# EAGLE schematic SchaltplanDoku (EAGLE 9.6.2)
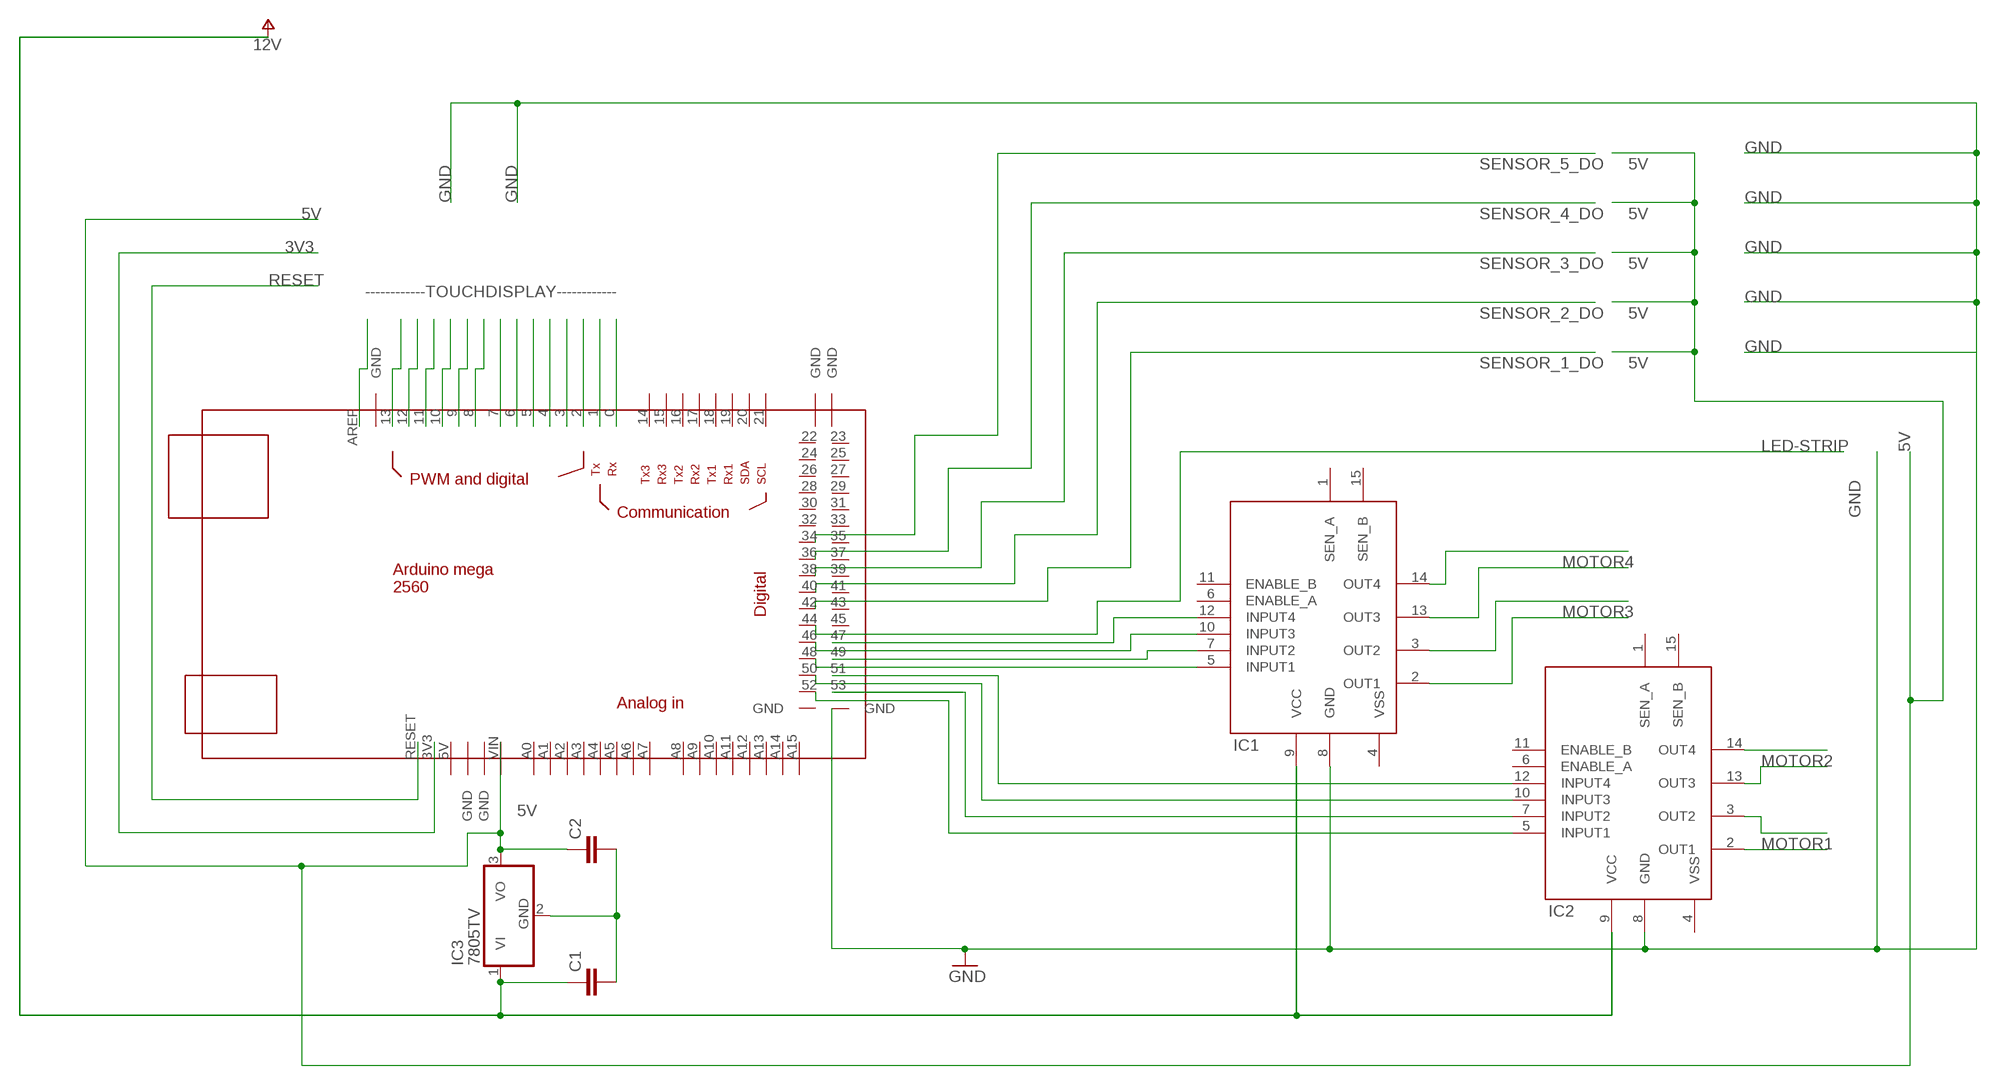
[diagram p0: schematic, sheet 1]

## Parts
C1  C2,5-3  [C2.5-3]
C2  C2,5-3  [C2.5-3]
IC1  L298  [MW-15]
IC2  L298  [MW-15]
IC3  7805TV  [TO220V]
U$1  MEGA_DEVICE  [MEGAOUTLINE]

## Nets
3V3: U$1.3V3
5V: C2.1 IC3.3(VO) U$1.VIN
GND: IC1.8(GND) IC2.8(GND) U$1.GND@7(GND)
LED-STRIP: U$1.44
MOTOR1: IC2.3(OUT2)
MOTOR2: IC2.14(OUT4)
MOTOR3: IC1.3(OUT2)
MOTOR4: IC1.14(OUT4)
N$1: IC2.12(INPUT4) U$1.51
N$2: IC2.10(INPUT3) U$1.50
N$3: C1.2 C2.2 IC3.2(GND)
N$4: IC2.2(OUT1)
N$5: IC2.7(INPUT2) U$1.53
N$6: IC2.5(INPUT1) U$1.52
N$7: IC1.5(INPUT1) U$1.48
N$8: IC1.7(INPUT2) U$1.49
N$9: IC1.10(INPUT3) U$1.46
N$10: IC1.12(INPUT4) U$1.47
N$11: IC1.2(OUT1)
N$12: U$1.13
N$13: IC1.13(OUT3)
N$14: U$1.12
N$15: IC2.13(OUT3)
N$16: U$1.11
N$17: U$1.10
N$18: U$1.9
N$19: U$1.8
N$20: U$1.7
N$21: U$1.AREF
N$22: U$1.6
N$23: U$1.5
N$24: U$1.4
N$25: U$1.3
N$26: U$1.2
N$27: U$1.1
N$28: U$1.0
RESET: U$1.RESET
SENSOR_1_DO: U$1.42
SENSOR_2_DO: U$1.40
SENSOR_3_DO: U$1.38
SENSOR_4_DO: U$1.36
SENSOR_5_DO: U$1.34
V+: C1.1 IC1.9(VCC) IC2.9(VCC) IC3.1(VI) ; supply symbol labelled 12V
Unconnected: IC1.1(SEN_A) IC1.6(ENABLE_A) IC1.11(ENABLE_B) IC1.15(SEN_B) IC2.1(SEN_A) IC2.6(ENABLE_A) IC2.11(ENABLE_B) IC2.15(SEN_B) U$1.5V U$1.14 U$1.15 U$1.16 U$1.17 U$1.18 U$1.19 U$1.20 U$1.21 U$1.22 U$1.23 U$1.24 U$1.25 U$1.26 U$1.27 U$1.28 U$1.29 U$1.30 U$1.31 U$1.32 U$1.33 U$1.35 U$1.37 U$1.39 U$1.41 U$1.43 U$1.45 U$1.A0 U$1.A1 U$1.A2 U$1.A3 U$1.A4 U$1.A5 U$1.A6 U$1.A7 U$1.A8 U$1.A9 U$1.A10 U$1.A11 U$1.A12 U$1.A13 U$1.A14 U$1.A15 U$1.GND@1(GND) U$1.GND@2(GND) U$1.GND@3(GND) U$1.GND@4(GND) U$1.GND@5(GND) U$1.GND@6(GND)

## Power pins joined to a net without a drawn wire
VSS: IC1.4(VSS) IC2.4(VSS)

## Library data of the parts
C1 C2 = capacitor-wima:C: CAPACITOR naming: grid - package width
IC1 IC2 = sgs-thom:L298
IC3 = linear:78*: Positive VOLTAGE REGULATOR Source: http://cache.national.com/ds/LM/LM78L05.pdf http://www.fairchildsemi.com/ds/LM/LM7805.pdf
U$1 = ArduinoMegaOutline:MEGA_DEVICE: mega card as device